# EAGLE design Arduino shield (EAGLE 9.6.1)
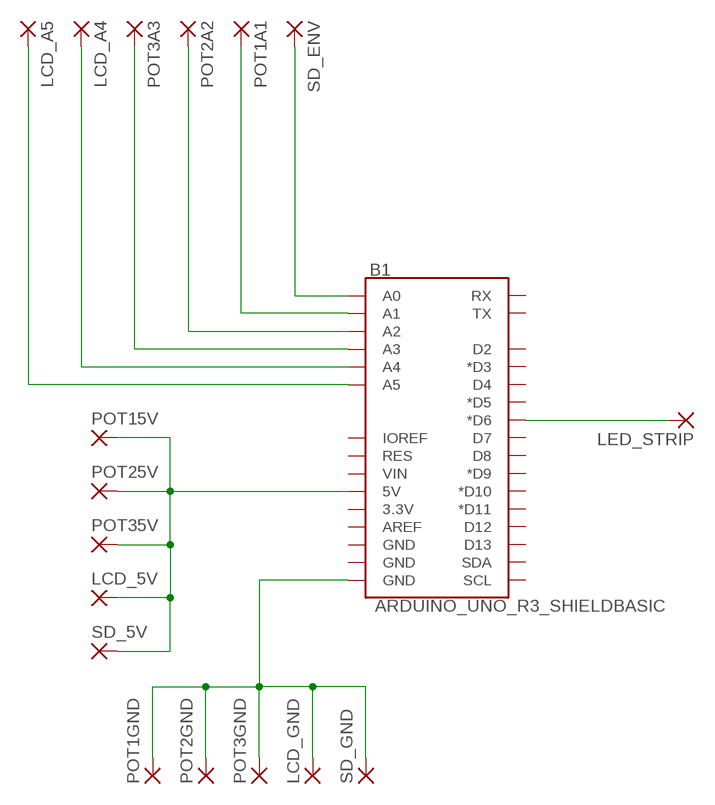
[diagram p0: schematic, sheet 1]

## Parts
B1  ARDUINO_UNO_R3_SHIELDBASIC  [UNO_R3_SHIELD]
LCD_5V  1,6/0,9  [1,6/0,9]
LCD_A4  1,6/0,9  [1,6/0,9]
LCD_A5  1,6/0,9  [1,6/0,9]
LCD_GND  1,6/0,9  [1,6/0,9]
LED_STRIP  1,6/0,9  [1,6/0,9]
POT1A1  1,6/0,9  [1,6/0,9]
POT1GND  1,6/0,9  [1,6/0,9]
POT2A2  1,6/0,9  [1,6/0,9]
POT2GND  1,6/0,9  [1,6/0,9]
POT3A3  1,6/0,9  [1,6/0,9]
POT3GND  1,6/0,9  [1,6/0,9]
POT15V  1,6/0,9  [1,6/0,9]
POT25V  1,6/0,9  [1,6/0,9]
POT35V  1,6/0,9  [1,6/0,9]
SD_5V  1,6/0,9  [1,6/0,9]
SD_ENV  1,6/0,9  [1,6/0,9]
SD_GND  1,6/0,9  [1,6/0,9]

## Nets
N$1: B1.A0 SD_ENV.1(P)
N$2: B1.A1 POT1A1.1(P)
N$3: B1.A2 POT2A2.1(P)
N$4: B1.A3 POT3A3.1(P)
N$5: B1.A4 LCD_A4.1(P)
N$6: B1.A5 LCD_A5.1(P)
N$7: B1.GND@0(GND) LCD_GND.1(P) POT1GND.1(P) POT2GND.1(P) POT3GND.1(P) SD_GND.1(P)
N$8: B1.5V LCD_5V.1(P) POT15V.1(P) POT25V.1(P) POT35V.1(P) SD_5V.1(P)
N$9: B1.D6(*D6) LED_STRIP.1(P)
Unconnected: B1.3.3V B1.AREF B1.D2 B1.D3(*D3) B1.D4 B1.D5(*D5) B1.D7 B1.D8 B1.D9(*D9) B1.D10(*D10) B1.D11(*D11) B1.D12 B1.D13 B1.GND@1(GND) B1.GND@2(GND) B1.IOREF B1.RES B1.RX B1.SCL B1.SDA B1.TX B1.VIN

## Library data of the parts
B1 = SparkFun-Boards:ARDUINO_UNO_R3_SHIELD: Arduino R3 Shield Footprint Shield form compatible with the Arduino Uno R3. SparkFun Products: MG2639 Cellular Shield <https://www.sparkfun.com/products/13120> MIDI Shield <https://www.sparkfun.com/products/12898> R3 Stackable Headers Kit <https://www.sparkfun.com/products/11417>
LCD_5V LCD_A4 LCD_A5 LCD_GND LED_STRIP POT1A1 POT1GND POT2A2 POT2GND POT3A3 POT3GND POT15V POT25V POT35V SD_5V SD_ENV SD_GND = wirepad:1,6/0,9: THROUGH-HOLE PAD

## Board
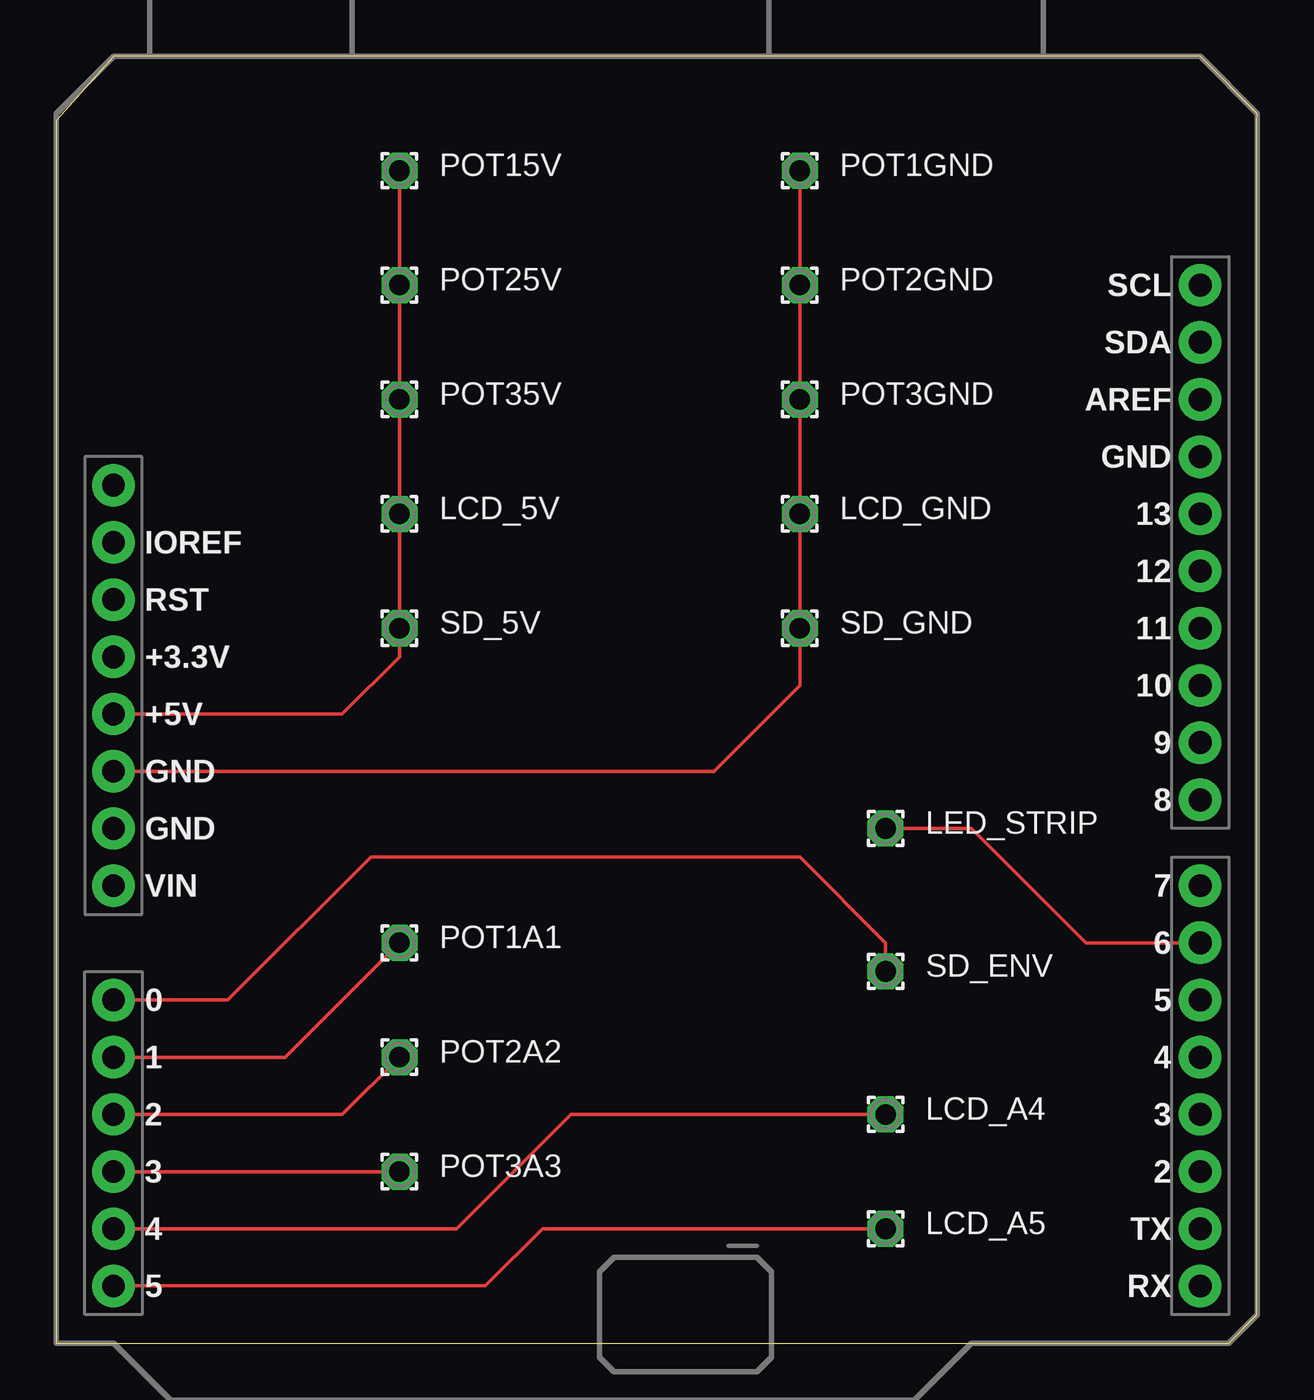
[diagram p1: board, top side]

Size 53.34 x 57.15 mm. Coordinates in mm from the lower left corner, seen from the top.
Outline: 0,0 52.07,0 53.32,1.27 53.32,54.28 53.34,54.61 50.8,57.15 2.54,57.15 0,54.28 0,0
Copper layers (1*16): Top 0.035mm / dielectric 1.5mm / Bottom 0.035mm
Design rules "default": minimum track width 6mil, minimum drill 0.35mm, track to track 6mil, track to pad 6mil, pad to pad 6mil, via to via 6mil, smd to smd 6mil, copper to edge 40mil, drill to drill 6mil, minimum pad ring 10mil, minimum via ring 8mil, stop-mask expansion 4mil, vias tented up to drill 0mil, thermal gap 10mil

### Footprints (pad centres in the part's own frame; a part is rotated, then mirrored left to right if it is on the bottom)
UNO_R3_SHIELD = drill 1.016 pad 1.88: 3.3V 24.13,-2.54; 5V 24.13,0; A0 24.13,12.7; A1 24.13,15.24; A2 24.13,17.78; A3 24.13,20.32; A4 24.13,22.86; A5 24.13,25.4; AREF -24.13,-13.97; D2 -24.13,20.32; D3 -24.13,17.78; D4 -24.13,15.24; D5 -24.13,12.7; D6 -24.13,10.16; D7 -24.13,7.62; D8 -24.13,3.81; D9 -24.13,1.27; D10 -24.13,-1.27; D11 -24.13,-3.81; D12 -24.13,-6.35; D13 -24.13,-8.89; GND@0 24.13,2.54; GND@1 24.13,5.08; GND@2 -24.13,-11.43; IOREF 24.13,-7.62; NC 24.13,-10.16; RES 24.13,-5.08; RX -24.13,25.4; SCL -24.13,-19.05; SDA -24.13,-16.51; TX -24.13,22.86; VIN 24.13,7.62
1,6/0,9 = drill 0.914 pad 1.6 octagon: 1 0,0

### Placement (x,y rotation side)
B1  26.67,27.94 180 top
LCD_5V  15.24,36.83 0 top
LCD_A4  36.83,10.16 0 top
LCD_A5  36.83,5.08 0 top
LCD_GND  33.02,36.83 0 top
LED_STRIP  36.83,22.86 0 top
POT1A1  15.24,17.78 0 top
POT1GND  33.02,52.07 0 top
POT2A2  15.24,12.7 0 top
POT2GND  33.02,46.99 0 top
POT3A3  15.24,7.62 0 top
POT3GND  33.02,41.91 0 top
POT15V  15.24,52.07 0 top
POT25V  15.24,46.99 0 top
POT35V  15.24,41.91 0 top
SD_5V  15.24,31.75 0 top
SD_ENV  36.83,16.51 0 top
SD_GND  33.02,31.75 0 top

### Tracks (layer width: path | path; a pad name or v marks a point on that pad's centre or on a via)
N$1
  Top 0.152: B1.A0 7.62,15.24 13.97,21.59 33.02,21.59 36.83,17.78 SD_ENV.1
N$2
  Top 0.152: B1.A1 10.16,12.7 POT1A1.1
N$3
  Top 0.152: POT2A2.1 12.7,10.16 B1.A2
N$4
  Top 0.152: B1.A3 POT3A3.1
N$5
  Top 0.152: LCD_A4.1 22.86,10.16 17.78,5.08 B1.A4
N$6
  Top 0.152: B1.A5 19.05,2.54 21.59,5.08 LCD_A5.1
N$7
  Top 0.152: B1.GND@0 29.21,25.4 33.02,29.21 SD_GND.1 LCD_GND.1 POT3GND.1 POT2GND.1 POT1GND.1
N$8
  Top 0.152: B1.5V 12.7,27.94 15.24,30.48 SD_5V.1 LCD_5V.1 POT35V.1 POT25V.1 POT15V.1
N$9
  Top 0.152: LED_STRIP.1 40.64,22.86 45.72,17.78 B1.D6